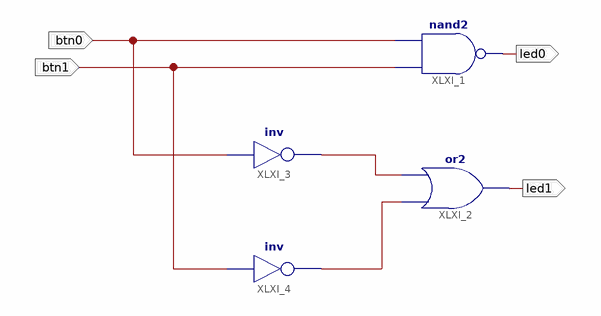
[diagram p0: schematic sheet 1]
// Xilinx ISE schematic elsoszorgalmi.sch (artix7) as structural Verilog: 4 symbols, 4 ports
module elsoszorgalmi (
  input  btn0,
  input  btn1,
  output led0,
  output led1
);

  wire XLXN_3, XLXN_4;

  nand XLXI_1 (led0, btn1, btn0);
  or XLXI_2 (led1, XLXN_3, XLXN_4);
  not XLXI_3 (XLXN_4, btn0);
  not XLXI_4 (XLXN_3, btn1);
endmodule
